# EAGLE design tello-encoder-generic-DaisyChain (EAGLE 9.6.2)

## Sheet 1 of 4
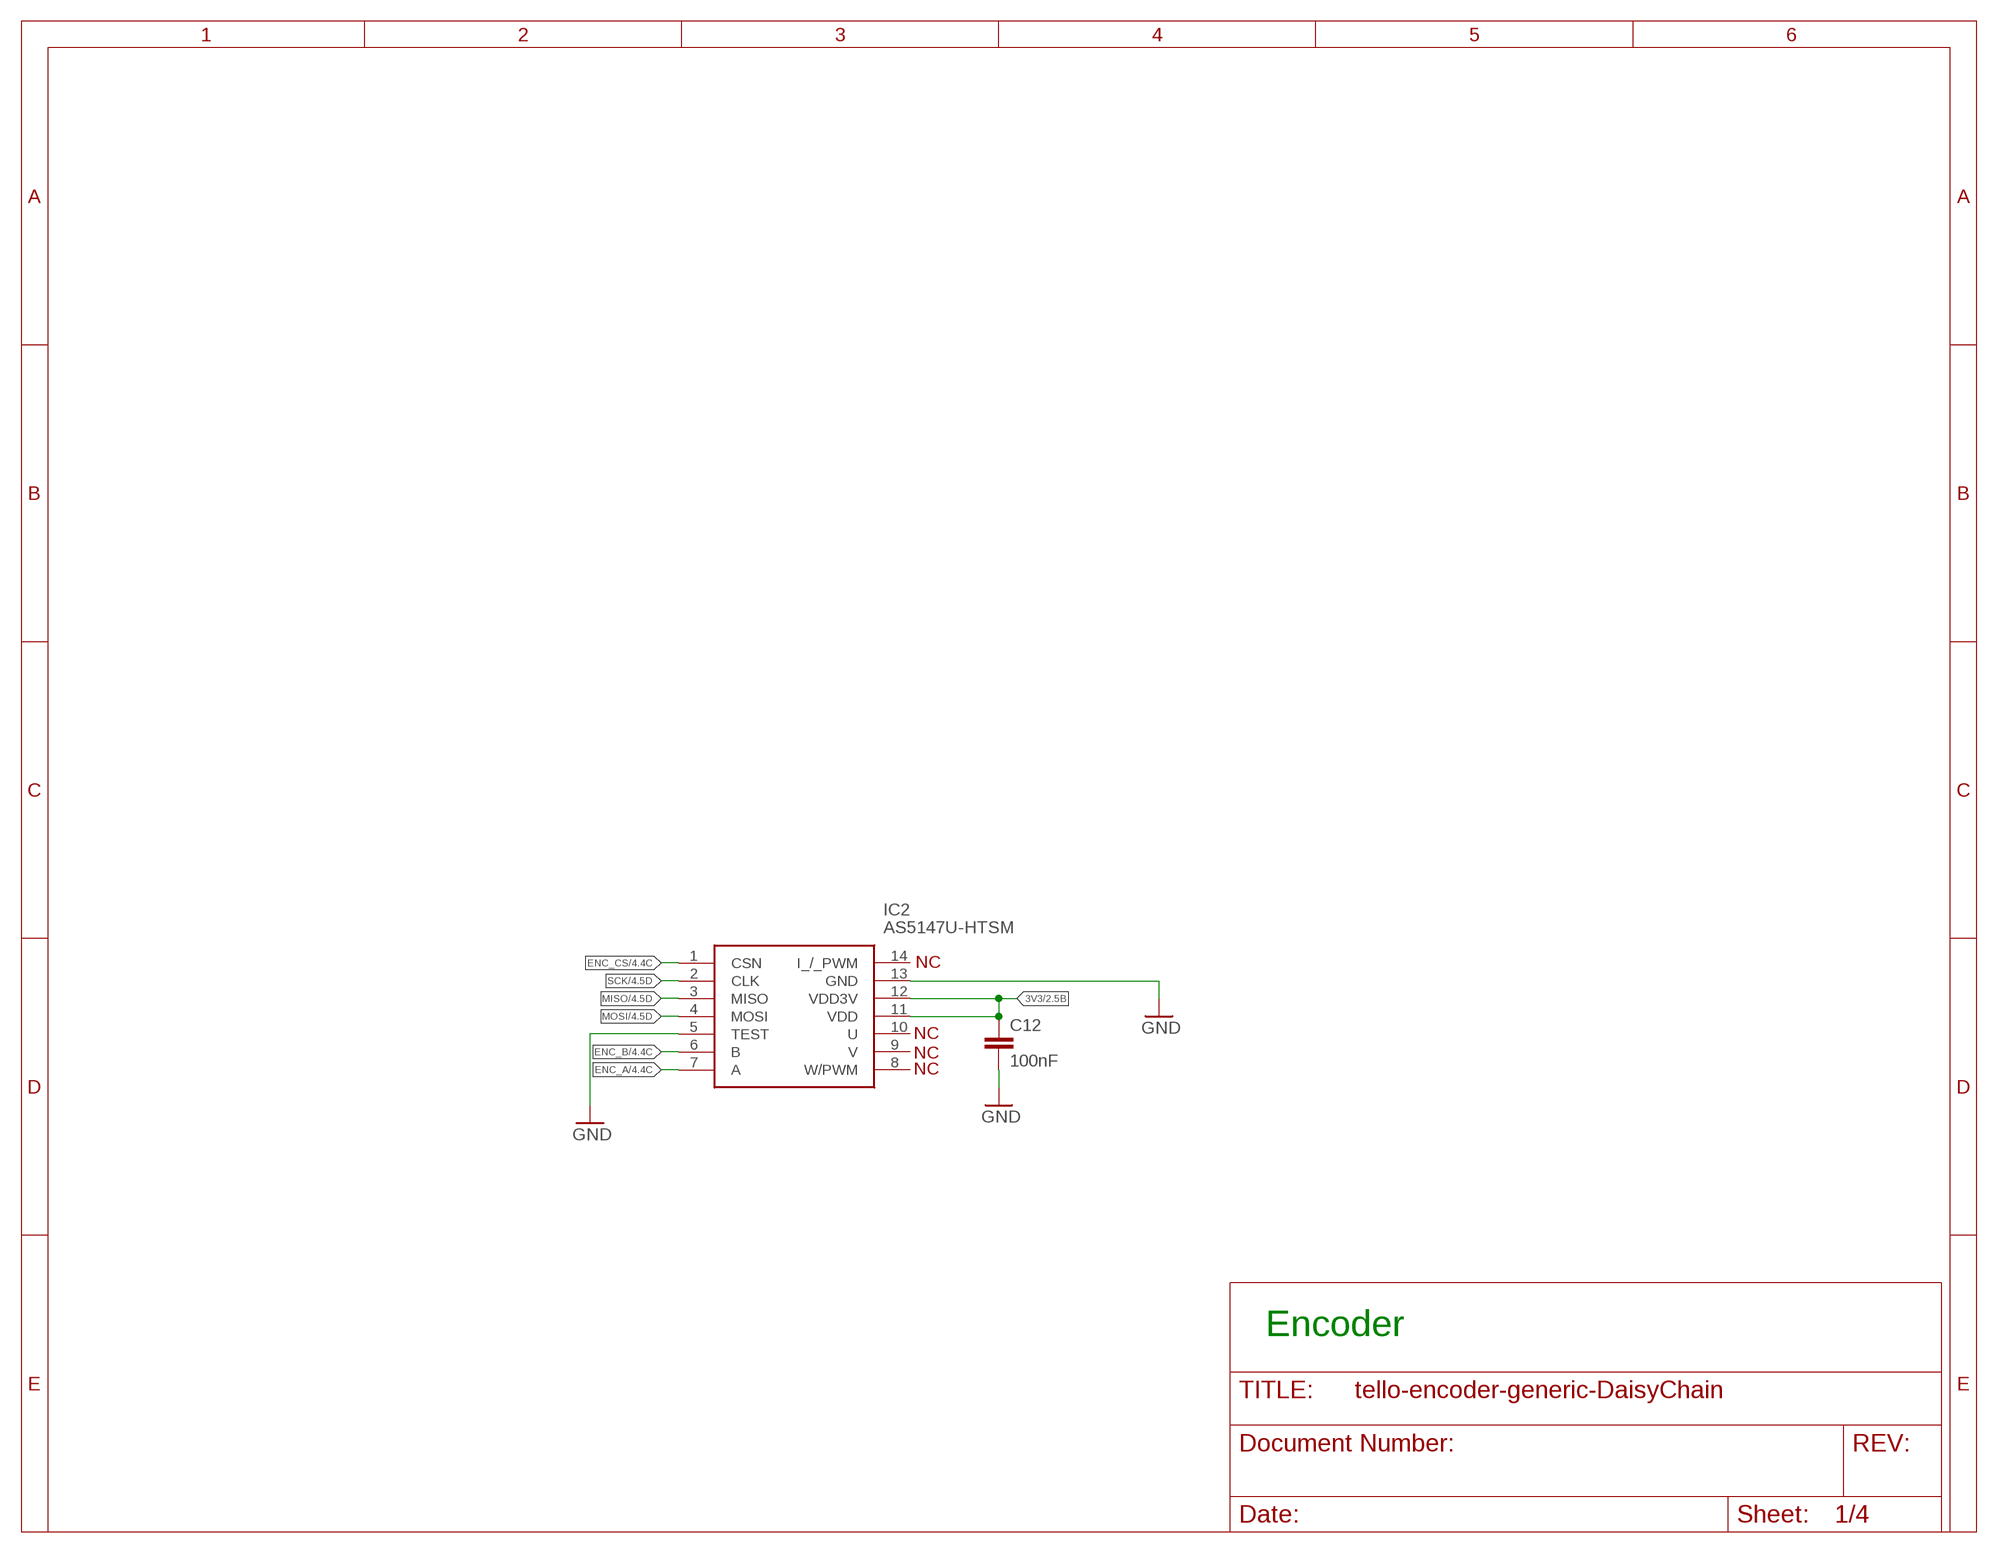
[diagram p0: schematic, sheet 1]

### Parts
C12  100nF  C-EUC0402  [C0402]
IC2  AS5147U-HTSM  [SOP65P640X120-14N]

### Nets
3V3: C12.1 IC2.11(VDD) IC2.12(VDD3V) ; also sheet 2,4
ENC_A: IC2.7(A) ; also sheet 4
ENC_B: IC2.6(B) ; also sheet 4
ENC_CS: IC2.1(CSN) ; also sheet 4
GND: C12.2 IC2.5(TEST) IC2.13(GND) ; also sheet 2,3,4
MISO: IC2.3(MISO) ; also sheet 4
MOSI: IC2.4(MOSI) ; also sheet 4
SCK: IC2.2(CLK) ; also sheet 4
Unconnected: IC2.8(W/PWM) IC2.9(V) IC2.10(U) IC2.14(I_/_PWM)

### Notes on the sheet
- NC
- NC
- NC
- NC
- Encoder

## Sheet 2 of 4
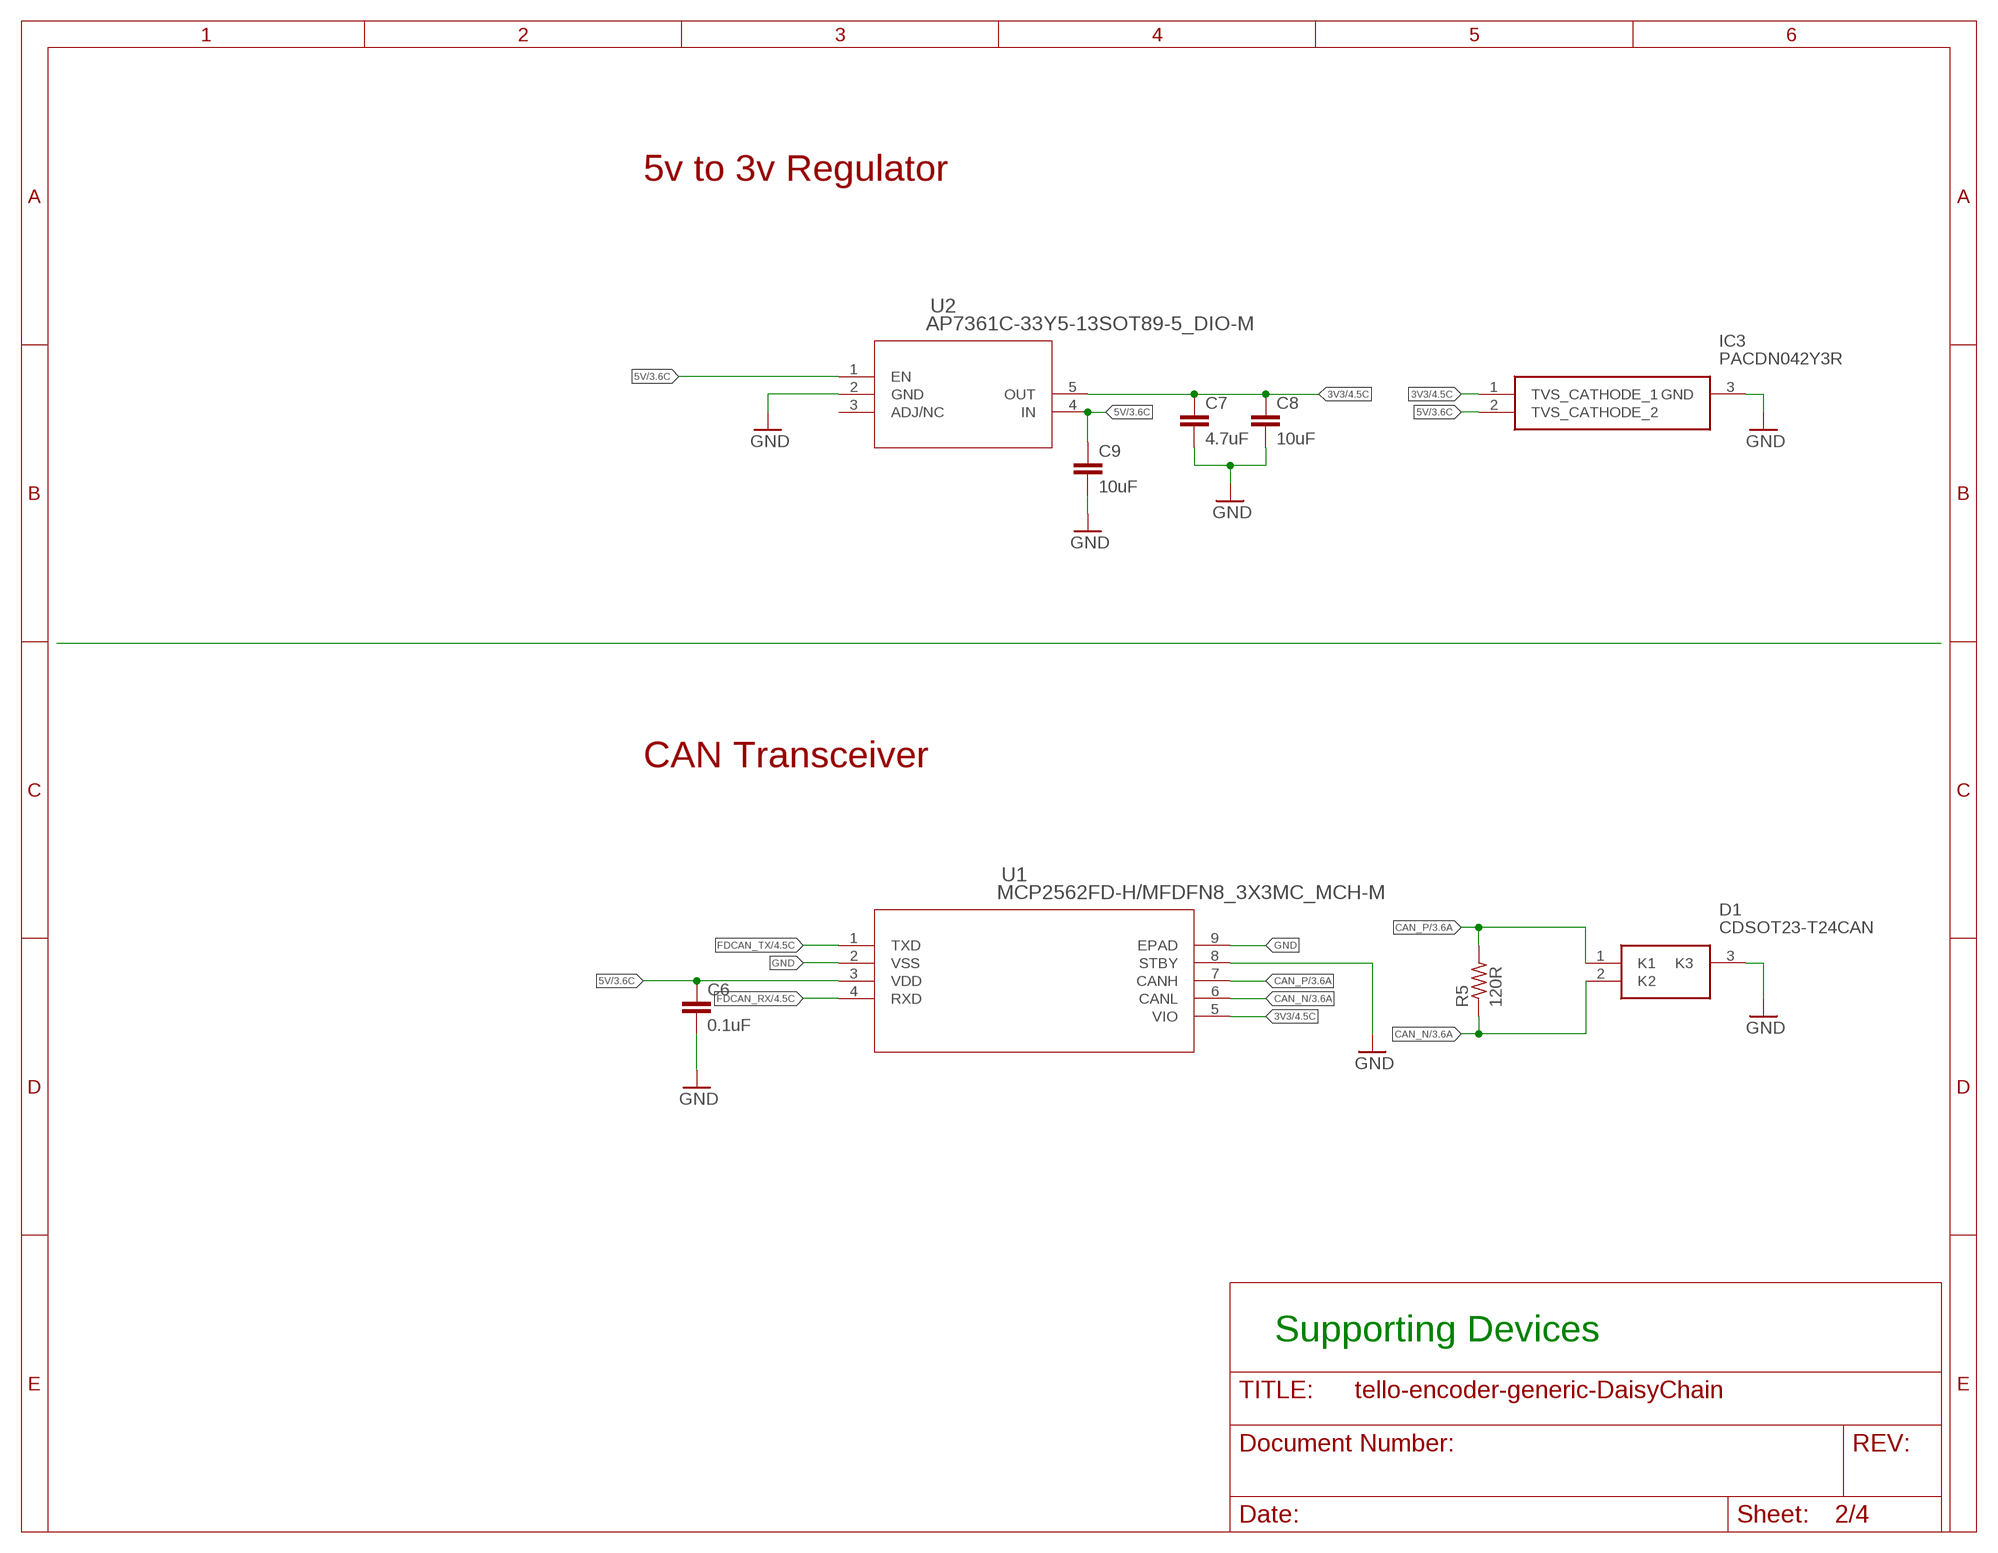
[diagram p1: schematic, sheet 2]

### Parts
C6  0.1uF  C-EUC0603  [C0603]
C7  4.7uF  C-EUC0603  [C0603]
C8  10uF  C-EUC0603  [C0603]
C9  10uF  C-EUC0603  [C0603]
D1  CDSOT23-T24CAN  [SOT95P230X117-3N]
IC3  PACDN042Y3R  [SOT96P237X111-3N]
R5  120R  R-US_R0402  [R0402]
U1  MCP2562FD-H/MFDFN8_3X3MC_MCH-M  [DFN8_3X3MC_MCH-M]
U2  AP7361C-33Y5-13SOT89-5_DIO-M  [SOT89-5_DIO-M]

### Nets
3V3: C7.1 C8.1 IC3.1(TVS_CATHODE_1) U1.5(VIO) U2.5(OUT) ; also sheet 1,4
5V: C6.1 C9.1 IC3.2(TVS_CATHODE_2) U1.3(VDD) U2.1(EN) U2.4(IN) ; also sheet 3
CAN_N [CAN]: D1.2(K2) R5.1 U1.6(CANL) ; also sheet 3
CAN_P [CAN]: D1.1(K1) R5.2 U1.7(CANH) ; also sheet 3
FDCAN_RX: U1.4(RXD) ; also sheet 4
FDCAN_TX: U1.1(TXD) ; also sheet 4
GND: C6.2 C7.2 C8.2 C9.2 D1.3(K3) IC3.3(GND) U1.2(VSS) U1.8(STBY) U1.9(EPAD) U2.2(GND) ; also sheet 1,3,4
Unconnected: U2.3(ADJ/NC)

### Notes on the sheet
- 5v to 3v Regulator
- CAN Transceiver
- Supporting Devices

## Sheet 3 of 4
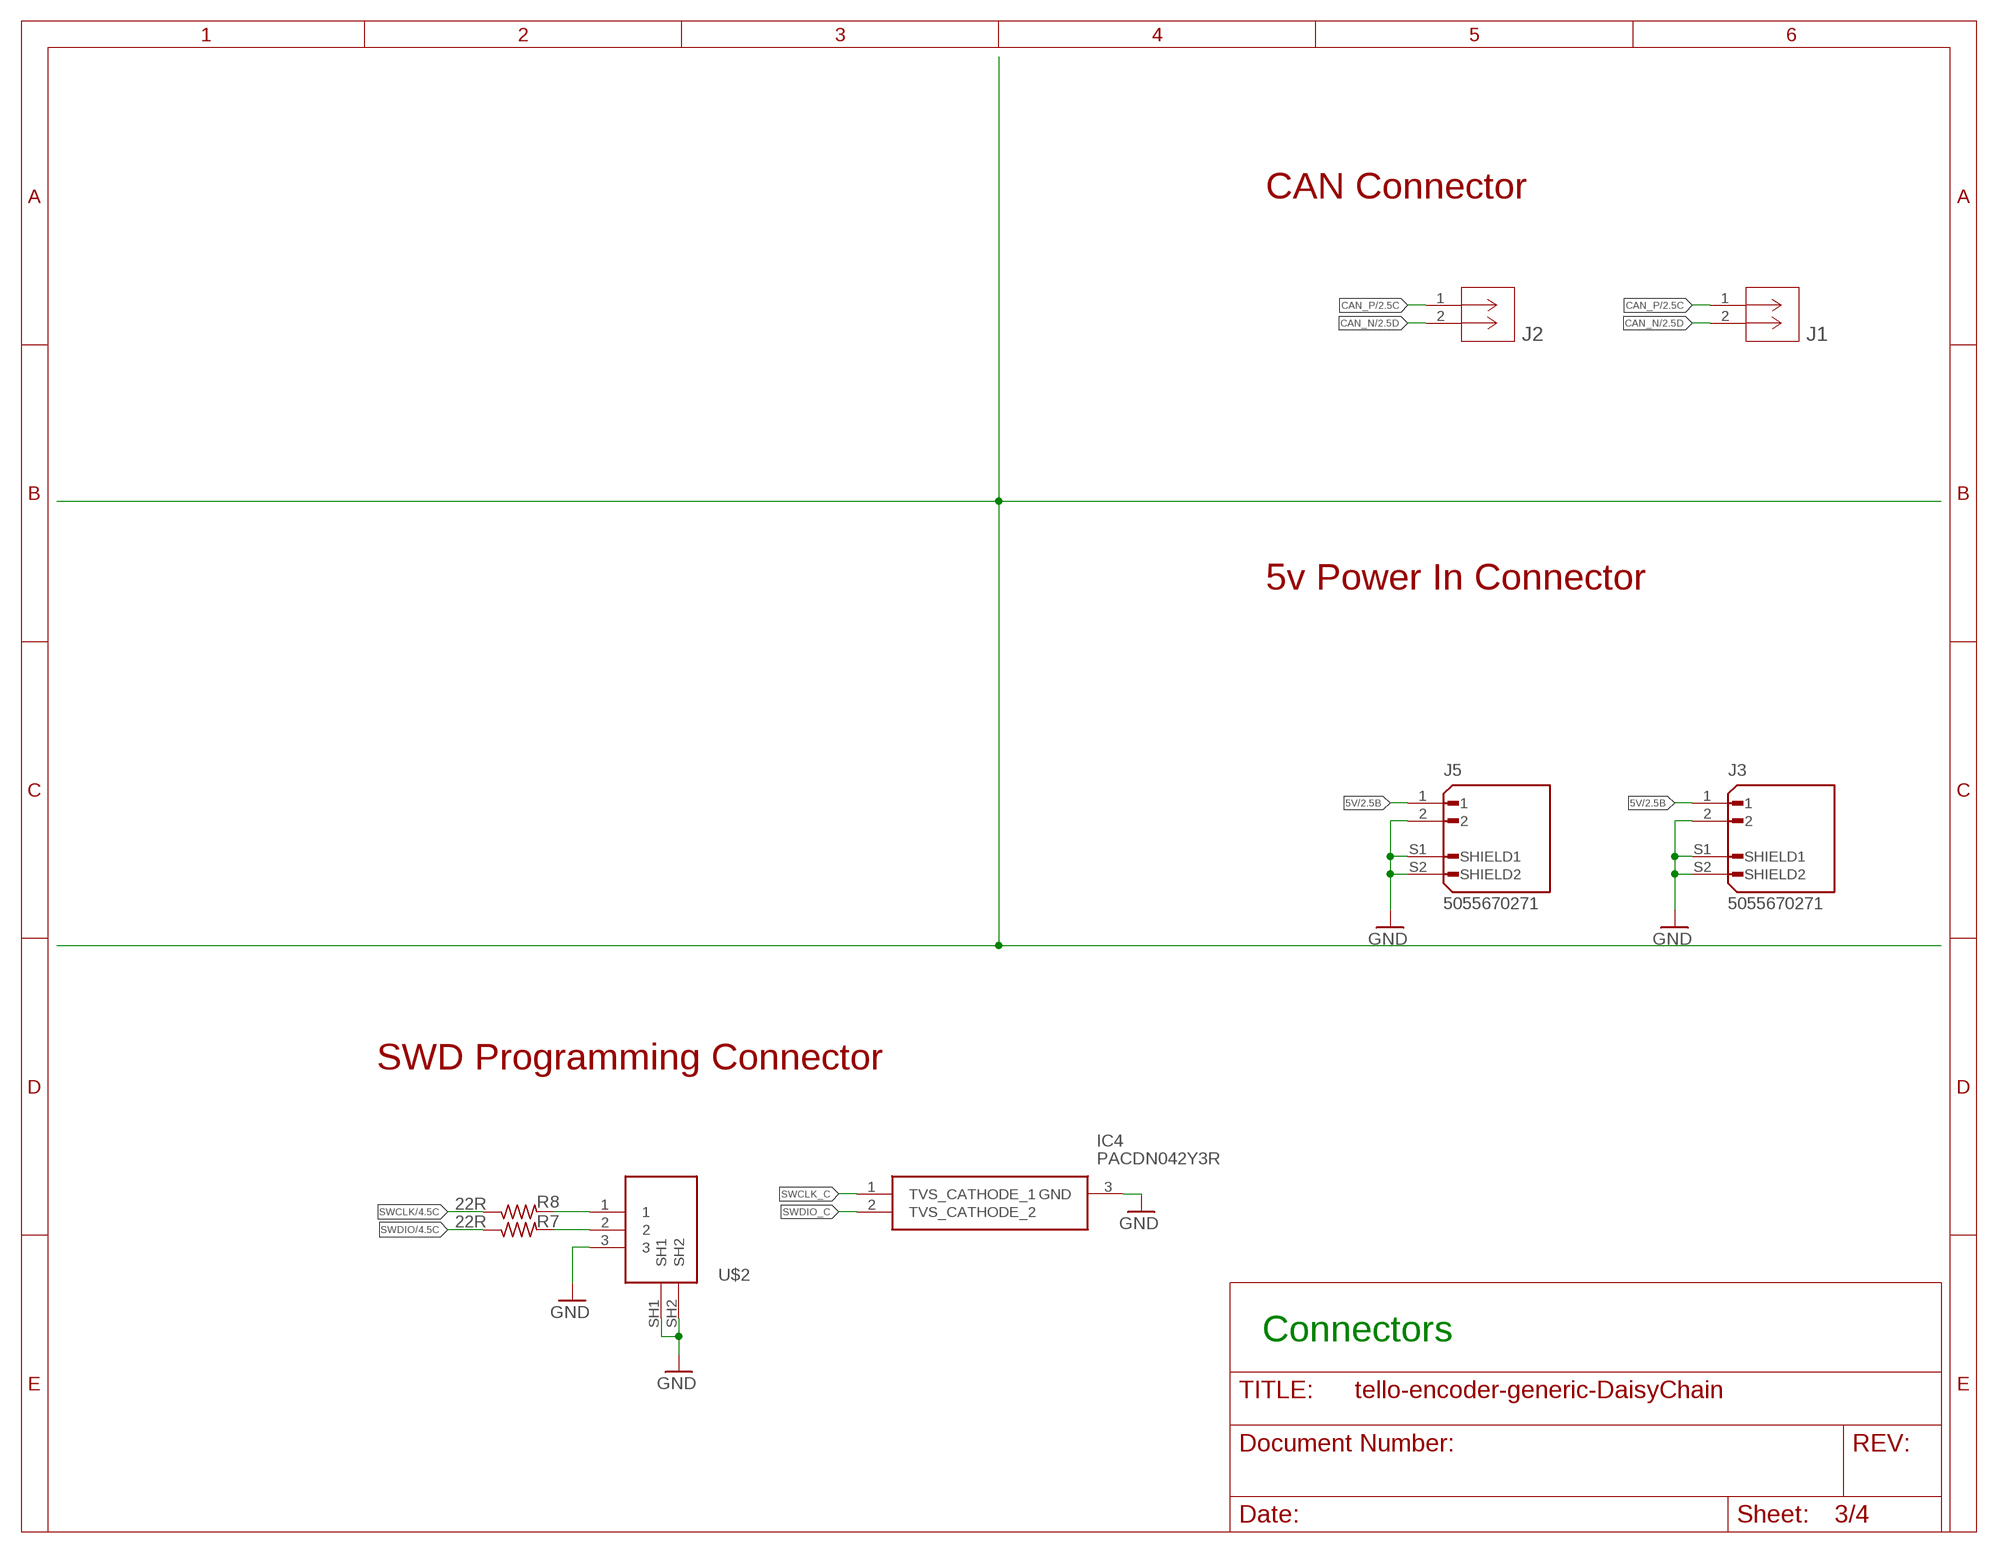
[diagram p2: schematic, sheet 3]

### Parts
IC4  PACDN042Y3R  [SOT96P237X111-3N]
J1  SM02BGHSTBLFSN  [CONN_SM02BGHSTB_JST]
J2  SM02BGHSTBLFSN  [CONN_SM02BGHSTB_JST]
J3  5055670271  [MOLEX_5055670271]
J5  5055670271  [MOLEX_5055670271]
R7  22R  R-US_R0402  [R0402]
R8  22R  R-US_R0402  [R0402]
U$2  125SH-G-03-TR-SMT  [125SH-G-03-TR-SMT]

### Nets
5V: J3.1 J5.1 ; also sheet 2
CAN_N [CAN]: J1.2 J2.2 ; also sheet 2
CAN_P [CAN]: J1.1 J2.1 ; also sheet 2
GND: IC4.3(GND) J3.2 J3.S1(SHIELD1) J3.S2(SHIELD2) J5.2 J5.S1(SHIELD1) J5.S2(SHIELD2) U$2.3 U$2.SH1 U$2.SH2 ; also sheet 1,2,4
SWCLK: R8.1 ; also sheet 4
SWCLK_C: IC4.1(TVS_CATHODE_1) R8.2 U$2.1
SWDIO: R7.1 ; also sheet 4
SWDIO_C: IC4.2(TVS_CATHODE_2) R7.2 U$2.2

### Notes on the sheet
- CAN Connector
- 5v Power In Connector
- SWD Programming Connector
- U$2
- Connectors

## Sheet 4 of 4
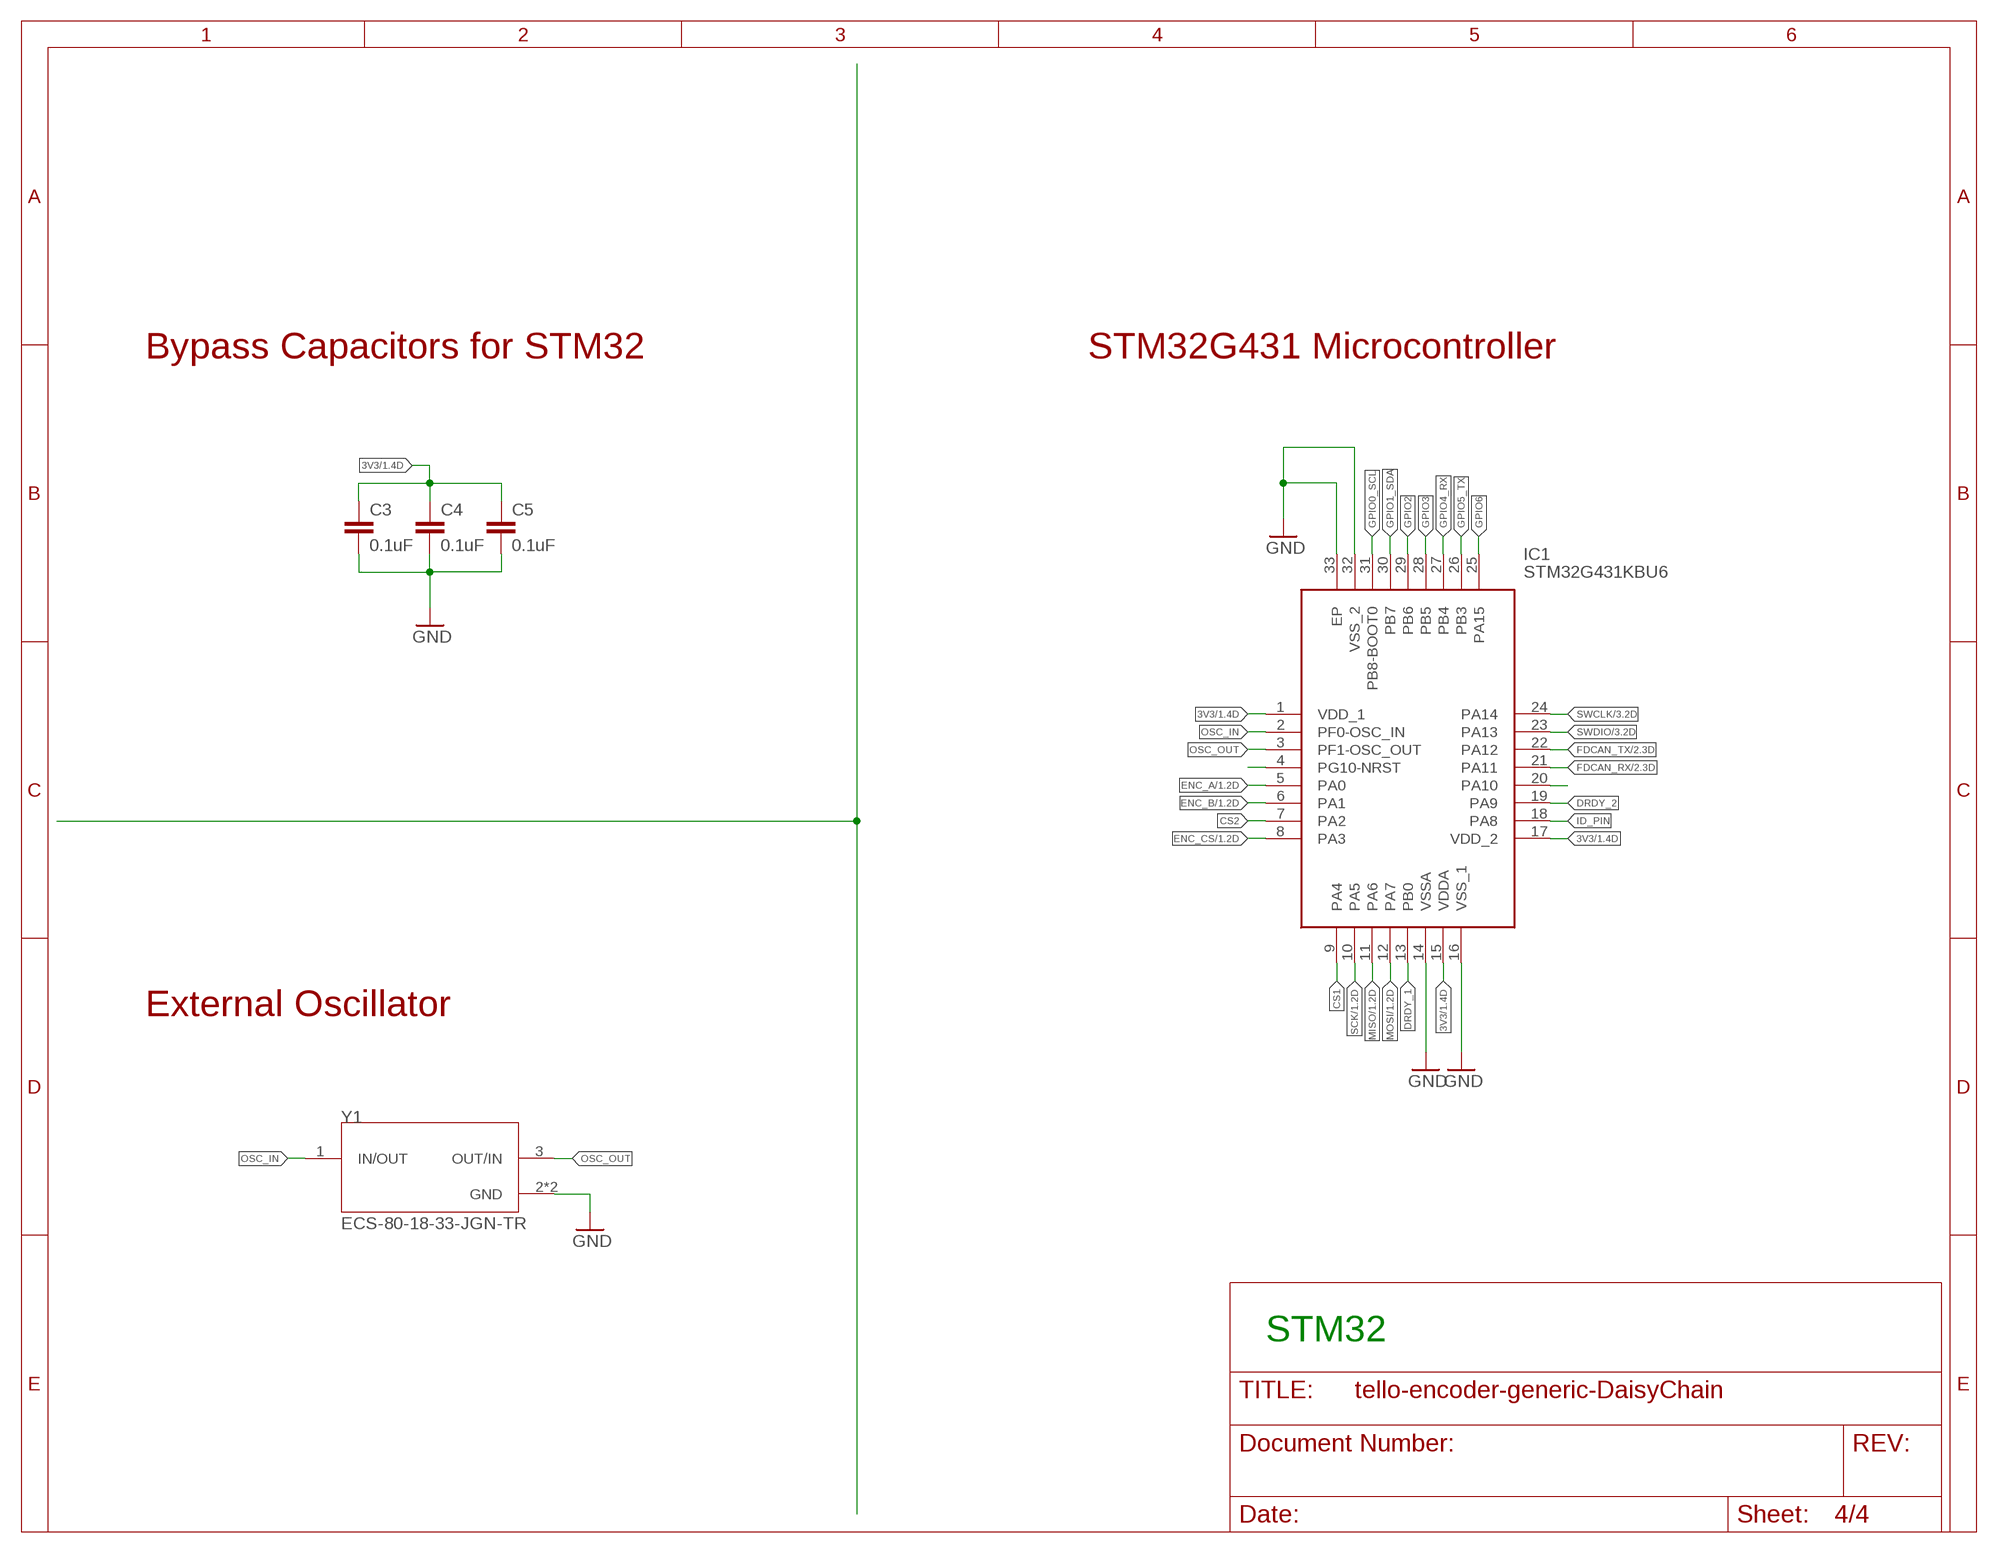
[diagram p3: schematic, sheet 4]

### Parts
C3  0.1uF  C-EUC0402  [C0402]
C4  0.1uF  C-EUC0402  [C0402]
C5  0.1uF  C-EUC0402  [C0402]
IC1  STM32G431KBU6  [QFN50P500X500X60-33N]
Y1  ECS-80-18-33-JGN-TR  [XTAL_ECS-240-8-33-AGN-TR]

### Nets
3V3: C3.1 C4.1 C5.1 IC1.1(VDD_1) IC1.15(VDDA) IC1.17(VDD_2) ; also sheet 1,2
CS1: IC1.9(PA4)
CS2: IC1.7(PA2)
DRDY_1: IC1.13(PB0)
DRDY_2: IC1.19(PA9)
ENC_A: IC1.5(PA0) ; also sheet 1
ENC_B: IC1.6(PA1) ; also sheet 1
ENC_CS: IC1.8(PA3) ; also sheet 1
FDCAN_RX: IC1.21(PA11) ; also sheet 2
FDCAN_TX: IC1.22(PA12) ; also sheet 2
GND: C3.2 C4.2 C5.2 IC1.14(VSSA) IC1.16(VSS_1) IC1.32(VSS_2) IC1.33(EP) Y1.2(GND) Y1.4(GND) ; also sheet 1,2,3
GPIO0_SCL: IC1.31(PB8-BOOT0)
GPIO1_SDA: IC1.30(PB7)
GPIO2: IC1.29(PB6)
GPIO3: IC1.28(PB5)
GPIO4_RX: IC1.27(PB4)
GPIO5_TX: IC1.26(PB3)
GPIO6: IC1.25(PA15)
ID_PIN: IC1.18(PA8)
MISO: IC1.11(PA6) ; also sheet 1
MOSI: IC1.12(PA7) ; also sheet 1
N$12: IC1.4(PG10-NRST)
N$28: IC1.20(PA10)
OSC_IN: IC1.2(PF0-OSC_IN) Y1.1(IN/OUT)
OSC_OUT: IC1.3(PF1-OSC_OUT) Y1.3(OUT/IN)
SCK: IC1.10(PA5) ; also sheet 1
SWCLK: IC1.24(PA14) ; also sheet 3
SWDIO: IC1.23(PA13) ; also sheet 3

### Notes on the sheet
- Bypass Capacitors for STM32 | STM32G431 Microcontroller
- External Oscillator
- STM32

## Library data of the parts
C3-C9 C12 = rcl:C-EU: CAPACITOR, European symbol; SPICEPREFIX: C
D1 = CDSOT23-T24CAN:CDSOT23-T24CAN: Bourns CDSOT23-T24CAN, Dual Bi-Directional ESD Protection Diode, 3-Pin SOT-23 Source: Datasheet <https://www.bourns.com/docs/Product-Datasheets/CDSOT23-T24CAN.pdf>; ARROW_PART_NUMBER: CDSOT23-T24CAN; ARROW_PRICE-STOCK: https://www.arrow.com/en/products/cdsot23-t24can/bourns?region=nac; DESCRIPTION: Bourns CDSOT23-T24CAN, Dual Bi-Directional ESD Protection Diode, 3-Pin SOT-23; HEIGHT: 1.17mm; MANUFACTURER_NAME: Bourns; MANUFACTURER_PART_NUMBER: CDSOT23-T24CAN; MOUSER_PART_NUMBER: 652-CDSOT23-T24CAN; MOUSER_PRICE-STOCK: https://www.mouser.co.uk/ProductDetail/Bourns/CDSOT23-T24CAN?qs=Z7P4xsdcg2LuAOb%2FzQ7xoQ%3D%3D
IC1 = STM32G431KBU6:STM32G431KBU6: STMICROELECTRONICS - STM32G431KBU6 - MCU, 32BIT, 170MHZ, UFQFPN-32 Source: Datasheet <https://www.st.com/resource/en/datasheet/stm32g431kb.pdf>; ARROW_PART_NUMBER: STM32G431KBU6; ARROW_PRICE-STOCK: https://www.arrow.com/en/products/stm32g431kbu6/stmicroelectronics?region=nac; DESCRIPTION: STMICROELECTRONICS - STM32G431KBU6 - MCU, 32BIT, 170MHZ, UFQFPN-32; HEIGHT: 0.6mm; MANUFACTURER_NAME: STMicroelectronics; MANUFACTURER_PART_NUMBER: STM32G431KBU6; MOUSER_PART_NUMBER: 511-STM32G431KBU6; MOUSER_PRICE-STOCK: https://www.mouser.co.uk/ProductDetail/STMicroelectronics/STM32G431KBU6?qs=T3oQrply3y%2Frk9w4R%2FCLxg%3D%3D
IC2 = AS5147U-HTSM:AS5147U-HTSM: Board Mount Hall Effect / Magnetic Sensors 14-Bit Dual-Die On-Axis Magnetic Rotary Position Sensor with Up to 14-Bit Binary Incremental Pulse Count Source: Datasheet <https://ams.com/documents/20143/36005/AS5147_DS000307_3-00.pdf>; ARROW_PART_NUMBER: AS5147U-HTSM; ARROW_PRICE-STOCK: https://www.arrow.com/en/products/as5147u-htsm/ams-ag?region=nac; DESCRIPTION: Board Mount Hall Effect / Magnetic Sensors 14-Bit Dual-Die On-Axis Magnetic Rotary Position Sensor with Up to 14-Bit Binary Incremental Pulse Count; HEIGHT: 1.2mm; MANUFACTURER_NAME: ams; MANUFACTURER_PART_NUMBER: AS5147U-HTSM; MOUSER_PART_NUMBER: 985-AS5147U-HTSM; MOUSER_PRICE-STOCK: https://www.mouser.co.uk/ProductDetail/ams/AS5147U-HTSM?qs=vLWxofP3U2ztCxAO5c%252BNHw%3D%3D
IC3 IC4 = PACDN042Y3R:PACDN042Y3R: Transient Voltage Suppressors and ESD Protectors Source: Datasheet <http://www.onsemi.com/pub/Collateral/PACDN042-D.PDF>; ARROW_PART_NUMBER: PACDN042Y3R; ARROW_PRICE-STOCK: https://www.arrow.com/en/products/pacdn042y3r/on-semiconductor; DESCRIPTION: Transient Voltage Suppressors and ESD Protectors; HEIGHT: 1.11mm; MANUFACTURER_NAME: onsemi; MANUFACTURER_PART_NUMBER: PACDN042Y3R; MOUSER_PART_NUMBER: 748-PACDN042Y3R; MOUSER_PRICE-STOCK: https://www.mouser.co.uk/ProductDetail/onsemi/PACDN042Y3R?qs=XcCBWJCwUGxb%252B%252BFbMKkIDQ%3D%3D
J1 J2 = SM02B-GHS-TB:SM02BGHSTBLFSN; COPYRIGHT: Copyright (C) 2022 Ultra Librarian. All rights reserved.; DIGI-KEY_PART_NUMBER_1: 455-1564-2-ND; DIGI-KEY_PART_NUMBER_2: 455-1564-1-ND; DIGI-KEY_PART_NUMBER_3: 455-1564-6-ND; MANUFACTURER_PART_NUMBER: SM02BGHSTBLFSN; MFR_NAME: JST
J3 J5 = 5055670271:5055670271: 1.25mm Pitch, Micro-Lock Plus PCB Header, Right-Angle, Surface Mount, 0.38µm Gold Plating, Positive Lock, 2 Circuits, Black; MANUFACTURER: Molex; MAXIMUM_PACKAGE_HEIGHT: 3.9 mm; PARTREV: C; STANDARD: Manufacturer Recommendations
R5 R7 R8 = rcl:R-US_: RESISTOR, American symbol; SPICEPREFIX: R
U1 = MCP2562FD:MCP2562FD-H/MF; COPYRIGHT: Copyright (C) 2023 Ultra Librarian. All rights reserved.; MANUFACTURER_PART_NUMBER: MCP2562FD-H/MF; MFR_NAME: Microchip
U2 = AP7361C-33Y5-13:AP7361C-33Y5-13; COPYRIGHT: Copyright (C) 2023 Ultra Librarian. All rights reserved.; MANUFACTURER_PART_NUMBER: AP7361C-33Y5-13; MFR_NAME: Diodes Inc
U$2 = 125SH-G-03-TR-SMT:125SH-G-03-TR-SMT
Y1 = ECS-80-18-33-JGN-TR:ECS-80-18-33-JGN-TR: The sub miniature ECX-32 is a compact SMD Crystal. The 3.2 x 2.5 x 0.8 mm ceramic package is ideal for today’s SMD manufacturing environment.; AVAILABILITY: Good; DESCRIPTION: The sub miniature ECX-32 is a compact SMD Crystal.; MF: ECS INC; MP: ECX-32; PACKAGE: SMD-4 ECX; STANDARD: Manufacturer recommendations

## Net classes
1 CAN: width 0.152 mm, clearance 0.229 mm

## Board
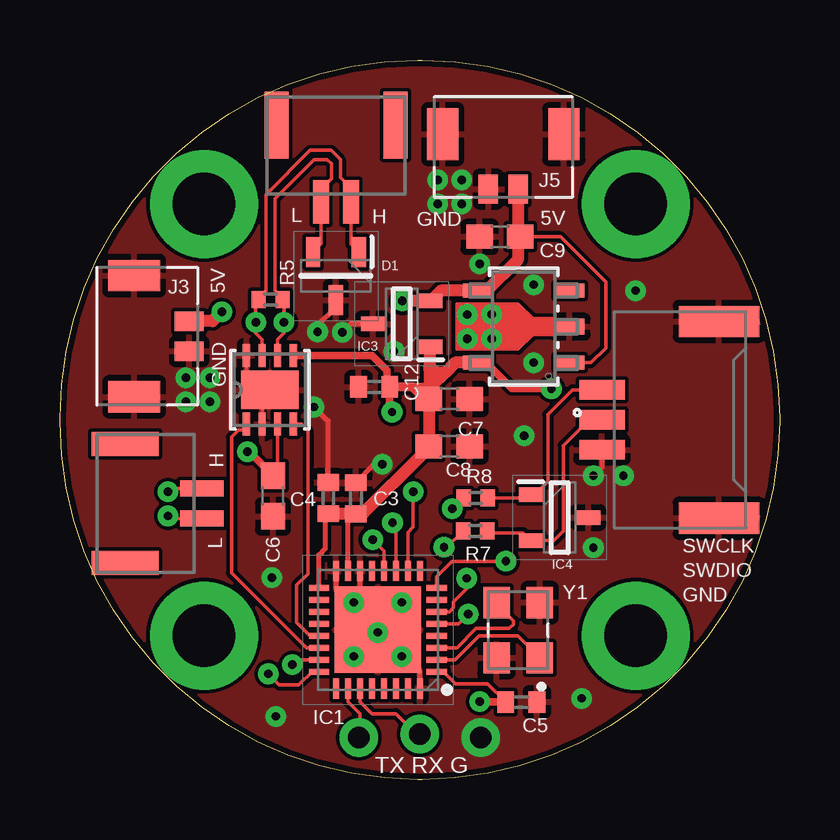
[diagram p4: board, top side]
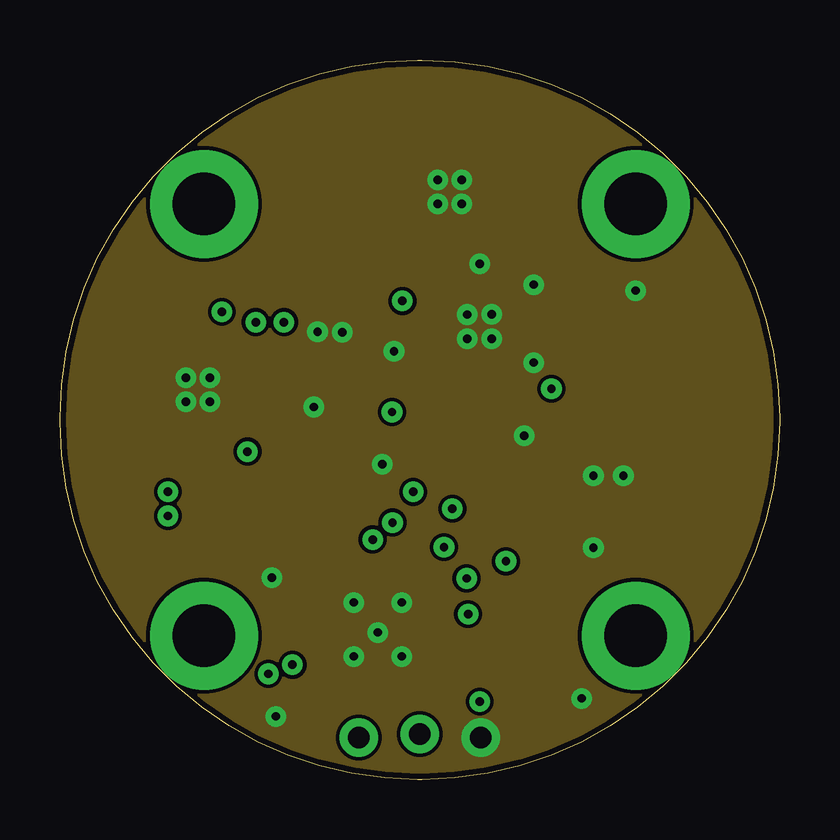
[diagram p5: board, inner layer Route2]
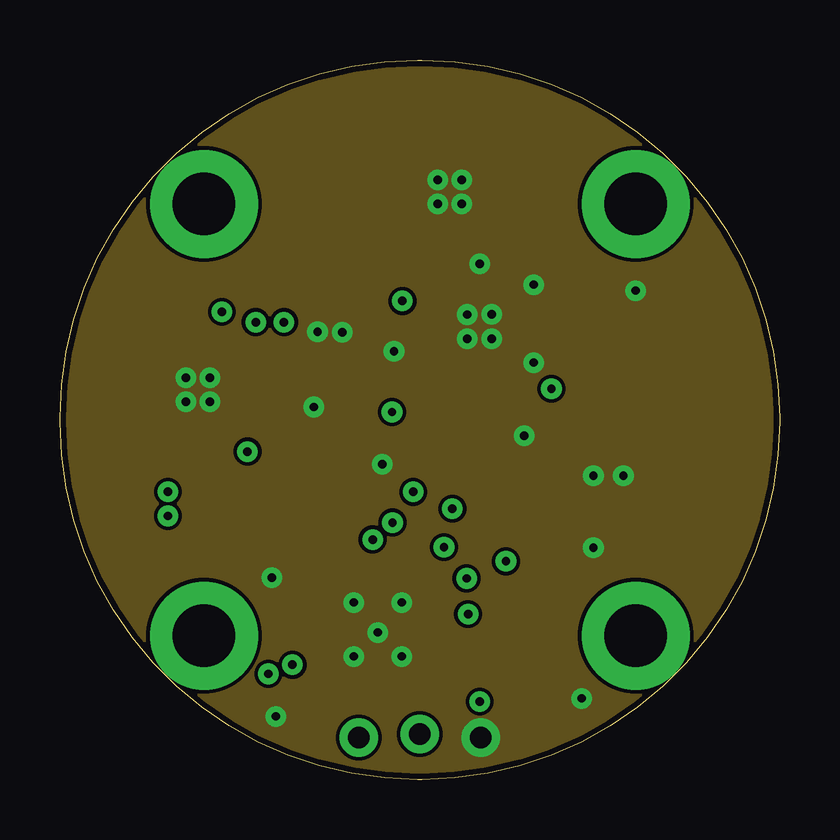
[diagram p6: board, inner layer Route15]
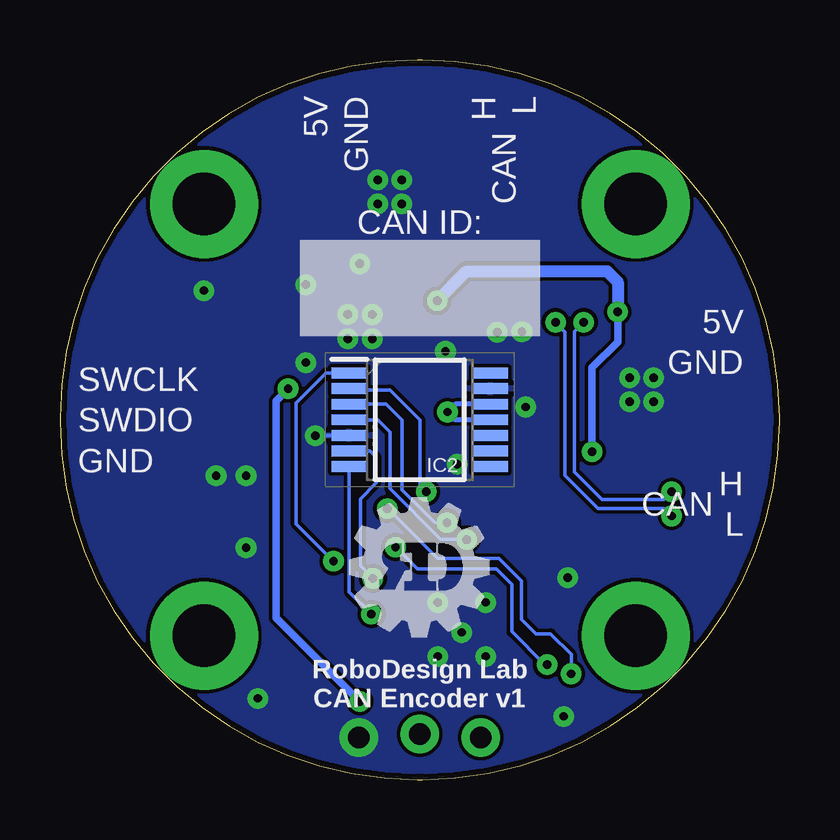
[diagram p7: board, bottom side, seen from below]

Size 30 x 30 mm. Coordinates in mm from the lower left corner, seen from the top.
Outline: 15.1,0 14.9,0 arc-90 0,14.9 0,15.1 arc-90 14.9,30 15.1,30 arc-90 30,15.1 30,14.9 arc-90 15.1,0
Copper layers (1+2*15+16): Top 0.035mm / dielectric 1.5mm / Route2 0.035mm / dielectric 0.15mm / Route15 0.035mm / dielectric 0.2mm / Bottom 0.035mm
Design rules "Circuitects-Rules *": minimum track width 6mil, minimum drill 0.3mm, track to track 6mil, track to pad 6mil, pad to pad 6mil, via to via 6mil, smd to smd 6mil, copper to edge 10mil, drill to drill 8mil, minimum pad ring 12mil, minimum via ring 10mil, stop-mask expansion 4mil, vias tented up to drill 25mil, thermal gap 10mil

### Footprints (pad centres in the part's own frame; a part is rotated, then mirrored left to right if it is on the bottom)
C0402 = smd 0.7 x 0.9: 1 -0.65,0; 2 0.65,0
C0603 = smd 1.1 x 1: 1 -0.85,0; 2 0.85,0
SOT95P230X117-3N = smd 1.25 x 0.6: 1 -1,0.95; 2 -1,-0.95; 3 1,0
QFN50P500X500X60-33N = smd 0.85 x 0.25: 1 -2.45,1.75; 2 -2.45,1.25; 3 -2.45,0.75; 4 -2.45,0.25; 5 -2.45,-0.25; 6 -2.45,-0.75; 7 -2.45,-1.25; 8 -2.45,-1.75; 17 2.45,-1.75; 18 2.45,-1.25; 19 2.45,-0.75; 20 2.45,-0.25; 21 2.45,0.25; 22 2.45,0.75; 23 2.45,1.25; 24 2.45,1.75 | smd 0.25 x 0.85: 9 -1.75,-2.45; 10 -1.25,-2.45; 11 -0.75,-2.45; 12 -0.25,-2.45; 13 0.25,-2.45; 14 0.75,-2.45; 15 1.25,-2.45; 16 1.75,-2.45; 25 1.75,2.45; 26 1.25,2.45; 27 0.75,2.45; 28 0.25,2.45; 29 -0.25,2.45; 30 -0.75,2.45; 31 -1.25,2.45; 32 -1.75,2.45 | smd 3.6 x 3.6: 33 0,0
SOP65P640X120-14N = smd 1.475 x 0.45: 1 -2.938,1.95; 2 -2.938,1.3; 3 -2.938,0.65; 4 -2.938,0; 5 -2.938,-0.65; 6 -2.938,-1.3; 7 -2.938,-1.95; 8 2.938,-1.95; 9 2.938,-1.3; 10 2.938,-0.65; 11 2.938,0; 12 2.938,0.65; 13 2.938,1.3; 14 2.938,1.95
SOT96P237X111-3N = smd 1 x 0.6: 1 -1.2,0.955; 2 -1.2,-0.955; 3 1.2,0
CONN_SM02BGHSTB_JST = smd 0.66 x 1.803: 1 -0.625,2.345; 2 0.625,2.345 | smd 0.991 x 2.794: 3 -2.475,-0.865; 4 2.475,-0.865
MOLEX_5055670271 = smd 0.8 x 1.2: 1 0.625,-1.75; 2 -0.625,-1.75 | smd 1.3 x 2.15: S1 -2.525,0.545; S2 2.525,0.545
R0402 = smd 0.6 x 0.7: 1 -0.5,0; 2 0.5,0
DFN8_3X3MC_MCH-M = smd 0.965 x 0.305: 1 -1.422,0.975; 2 -1.422,0.325; 3 -1.422,-0.325; 4 -1.422,-0.975; 5 1.422,-0.975; 6 1.422,-0.325; 7 1.422,0.325; 8 1.422,0.975 | smd 1.6 x 2.413: 9 0,0
SOT89-5_DIO-M = smd 0.583 x 1.24: 1 -1.5,-1.915; 3 1.5,-1.915; 4 1.5,1.915; 5 -1.5,1.915 | smd 0.66 x 1.24: 2 0,-1.915
125SH-G-03-TR-SMT = smd 0.8 x 1.9: 1 1.25,0; 2 0,0; 3 -1.25,0 | smd 1.3 x 3.35: SH1 4.1,-4.875; SH2 -4.1,-4.875
XTAL_ECS-240-8-33-AGN-TR = smd 1.3 x 1.1: 1 -1.15,-0.9; 2 1.15,-0.9; 3 1.15,0.9; 4 -1.15,0.9

### Placement (x,y rotation side)
C3  12.34,11.72 90 top
C4  11.19,11.74 90 top
C5  19.23,3.23 0 top
C6  8.88,11.82 270 top
C7  16.23,15.86 0 top
C8  16.23,13.89 0 top
C9  18.34,22.63 180 top
C12  13.1,16.37 180 top
D1  11.5,21 270 top
IC1  13.25,6.25 180 top
IC2  15,15 0 bottom
IC3  14.25,19 180 top
IC4  20.83,10.92 0 top
J1  3.58,11.51 270 top
J2  11.51,26.42 180 top
J3  3.64,18.48 90 top
J5  18.48,26.36 0 top
R5  8.78,20.01 180 top
R7  17.32,10.36 0 top
R8  17.33,11.74 0 top
U1  8.75,16.25 90 top
U2  19.33,18.88 90 top
U$2  22.6,15 90 top
Y1  19.1,6.23 90 top

### Tracks (layer width: path | path; a pad name or v marks a point on that pad's centre or on a via)
3V3  (via drill 0.35)
  Top 0.152: C5.1 17.82,4 16.49,4 15.99,4.5 IC1.1
  Top 0.203: IC1.15 12,10.73 C3.1 | 11.06,11.07 11.06,9.63 10.8,9.37 IC1.17
  Top 0.305: v17.5,3.25 18.57,3.25 C5.1 | U2.5 17.76,17.38 18.84,16.29 v20.49,16.29 | v13.84,15.32 13.75,15.41 C12.1 13.64,16.48 13.64,17.05 13.02,17.67 U1.5
  Top 0.381: C7.1 15.1,15.86 15.1,15.97 14.71,16.37 | 14.71,16.37 C12.1 | 15.4,16.31 15.35,16.37 14.7,16.37 14.71,16.37
  Top 0.508: IC3.1 15.4,18 15.4,17.24 | 15.4,17.24 15.4,17.1 | 15.4,17.1 15.4,16.31 | 15.4,16.31 C7.1 C8.1 15.11,13.73 15.11,13.56 12.62,11.07 C3.1 11.2,11.07 | 11.06,11.07 11.21,11.07 11.2,11.07 | 11.2,11.07 C4.1 | U2.5 16.47,17.38 16.05,16.95 | 16.05,16.95 15.87,16.77 | 15.87,16.77 15.4,16.31 | 15.4,16.31 | 16.05,16.95 15.55,16.95 15.4,17.1 | 15.87,16.77 15.4,17.24
  Bottom 0.203: IC2.11 13.52,15 v13.84,15.32 13.51,15.65 IC2.12
  Bottom 0.305: v20.49,16.29 21,15.78 21,6.75 v17.5,3.25
5V  (via drill 0.35)
  Top 0.152: U2.1 22.13,17.38 22.75,18 22.75,20.75 20.87,22.63 C9.1 | U1.3 9.07,12.87 C6.1 | U2.4 17,20.38
  Top 0.305: J5.1 19.11,24.13 | U2.4 17.78,20.38 | C6.1 7.88,13.67 v7.82,13.67
  Top 0.508: 19.11,22.71 19.11,24.13 | 19.11,22.71 C9.1 | 19.11,22.71 19.11,21.71 17.78,20.38 | 17,20.38 15.88,20.38 IC3.2 v14.28,19.95 v14.28,19.96 | v6.75,19.5 6.36,19.11 J3.1
  Bottom 0.305: v7.82,13.67 7.82,17.18 6.75,18.25 v6.75,19.5
  Bottom 0.508: v14.28,19.96 13.04,21.19 7.19,21.19 6.75,20.75 v6.75,19.5
CAN_N  (via drill 0.35)
  Top 0.152: D1.2 10.88,22.34 J2.2 10.88,24.63 11.31,25.06 11.31,25.67 11.14,25.85 10.59,25.85 8.97,24.23 8.97,20.39 9.28,20.08 R5.1 9.34,19.95 v9.34,19.07 9.34,18.61 9.07,18.35 U1.6 | J1.2 4.61,10.88 v4.5,10.99
  Bottom 0.152: v4.5,10.99 4.81,11.3 7.57,11.3 8.94,12.67 8.94,18.67 v9.34,19.07
CAN_P  (via drill 0.35)
  Top 0.152: D1.1 12.13,22.32 J2.1 12.13,24.66 11.7,25.09 11.7,25.84 11.3,26.23 10.43,26.23 8.59,24.39 8.59,20.38 8.28,20.07 R5.2 8.16,19.89 v8.16,19.07 8.16,18.61 8.43,18.34 U1.7 | J1.1 4.63,12.13 v4.5,12
  Bottom 0.152: v4.5,12 4.82,11.68 7.41,11.68 8.56,12.83 8.56,18.67 v8.16,19.07
ENC_A  (via drill 0.35)
  Top 0.152: v17.01,6.9 16.62,6.5 IC1.5
  Bottom 0.152: IC2.7 17.94,7.82 v17.01,6.9
ENC_B  (via drill 0.35)
  Top 0.152: IC1.6 16.24,7 16.41,7.17 16.41,7.41 16.95,7.95 v16.95,8.38
  Bottom 0.152: IC2.6 17.06,13.7 16.83,13.46 16.83,12.36 17.47,11.71 17.47,8.9 v16.95,8.38
ENC_CS  (via drill 0.35)
  Top 0.152: IC1.8 15.7,8.45 16.35,9.1 v18.6,9.1
  Bottom 0.152: v18.6,9.1 20.15,10.66 20.15,15.7 18.9,16.95 IC2.1
FDCAN_RX
  Top 0.152: U1.4 10.06,14.83 10.34,14.55 10.34,8.58 9.88,8.12 9.88,6.55 10.42,6 IC1.21
FDCAN_TX
  Top 0.152: U1.1 7.78,14.57 7.45,14.57 7.16,14.27 7.16,8.62 10.27,5.5 IC1.22
GND  (via drill 0.35, 0.9 pad 1.6)
  Top 0.152: U1.2 8.43,15.93 8.62,16.12 | 8.62,16.12 U1.9 | U1.8 7.78,16.98 8.62,16.12
  Top 0.203: IC3.3 12.13,19 v11.78,18.65 | D1.3 11.5,19.68 10.74,18.92 v10.74,18.66 | U$2.3 22.6,13.02 v22.24,12.66 | v10.58,15.53 10.61,15.53 11.19,14.95 C4.2 | C3.2 13.12,13.15 v13.44,13.15 | IC1.14 12.5,7.63 v12.25,7.38 12.12,7.38 11.5,8 IC1.16 | IC1.32 15,4.5 14.37,5.13 v14.25,5.13
  Bottom 0.152: IC2.5 19.34,14.35 v19.36,14.33
  other vias: 15.75,25 16.75,25 15.75,24 16.75,24 17.5,21.5 16.98,19.39 16.98,18.37 18,18.37 18,19.39 22.24,9.66 23.49,12.66 13.93,17.86 21.75,3.38 24,20.38 19.75,20.63 19.75,17.38 17.54,1.75 9,2.63 14.25,7.38 12.25,5.13 13.25,6.13 6.25,16.75 5.25,16.75 5.25,15.75 6.25,15.75 8.84,8.42
  pour Top (rank 5): 2.75,32 27.75,32 32.75,27 32.75,4 26.5,-2.25 3.5,-2.25 -2.5,3.75 -2.5,26.75
  pour Route2 (rank 5): 3,31.75 28,31.75 33,26.75 33,4 26.5,-2.5 3.75,-2.5 -2.25,3.5 -2.25,26.5
  pour Route15 (rank 5): 3.25,31.5 28.25,31.5 33.25,26.5 33.25,3.75 26.75,-2.75 4,-2.75 -2,3.25 -2,26.25
  pour Bottom (rank 5): 3.5,31.25 28.5,31.25 33.5,26.25 33.5,3.5 27,-3 4.25,-3 -1.75,3 -1.75,26
GPIO4_RX  (via drill 0.9 pad 1.6)
  Top 0.152: IC1.27 12.5,3.25 13,2.75 14,2.75 14.85,1.9 v15,1.9
GPIO5_TX  (via drill 0.9 pad 1.6)
  Top 0.152: IC1.26 12,3.25 12.5,2.75 12.5,1.79 v12.46,1.75
MISO  (via drill 0.35)
  Top 0.152: v13.87,10.71 14,10.58 IC1.11
  Bottom 0.152: IC2.3 16.4,15.65 15.75,15 15.75,12.07 14.39,10.71 v13.87,10.71
MOSI  (via drill 0.35)
  Top 0.152: v13.03,10 13.03,9.99 13.5,9.52 IC1.12
  Bottom 0.152: IC2.4 16.75,15 16.25,14.5 16.25,12.13 14.13,10 v13.03,10
N$1  (via drill 2.6 pad 4.5)
  other vias: 24,24
N$2  (via drill 2.6 pad 4.5)
  other vias: 24,6
N$3  (via drill 2.6 pad 4.5)
  other vias: 6,24
N$4  (via drill 2.6 pad 4.5)
  other vias: 6,6
OSC_IN
  Top 0.152: Y1.1 19.09,5.99 17.46,5.99 16.48,5 IC1.2
OSC_OUT
  Top 0.152: Y1.3 18.2,7.33 18.91,6.62 18.91,6.47 18.73,6.29 17.34,6.29 16.55,5.5 IC1.3
SCK  (via drill 0.35)
  Top 0.152: v14.73,11.99 14.73,10.54 14.5,10.31 IC1.10
  Bottom 0.152: IC2.2 17.89,16.25 16.25,16.25 15,15 15,12.27 v14.73,11.99
SWCLK  (via drill 0.35)
  Top 0.152: R8.1 16.39,11.29 v16.36,11.29 | v8.69,4.41 9.15,3.95 9.95,3.95 10.5,4.5 IC1.24
  Bottom 0.152: v16.36,11.29 16.34,11.29 14.25,9.21 11.7,9.21 10.77,8.28 10.77,6.68 10.16,6.08 9.54,6.08 8.69,5.22 v8.69,4.41
SWCLK_C
  Top 0.152: U$2.1 21.38,16.25 20.34,15.22 20.34,12.42 19.79,11.88 IC4.1 19.5,11.74 R8.2
SWDIO  (via drill 0.35)
  Top 0.152: R7.1 16.14,9.69 v16.01,9.69 | v9.7,4.79 9.91,5 IC1.23
  Bottom 0.152: v16.01,9.69 15.1,8.78 11.8,8.78 11.16,8.14 11.16,6.17 9.78,4.79 v9.7,4.79
SWDIO_C
  Top 0.152: U$2.2 22.05,15 20.99,13.94 20.99,10.36 20.59,9.96 IC4.2 19.31,10.29 17.89,10.29 R7.2

### Text on the board
tPlace: GND | L | H | 5V | 5V | GND | H | L | SWCLK / SWDIO / GND | TX RX G
bPlace: H / L | 5V / GND | CAN | CAN ID: | 5V / GND | SWCLK / SWDIO / GND | H / L | CAN | RoboDesign Lab / CAN Encoder v1